# EAGLE design v3 Painting Machine Schematic (EAGLE 9.3.0)
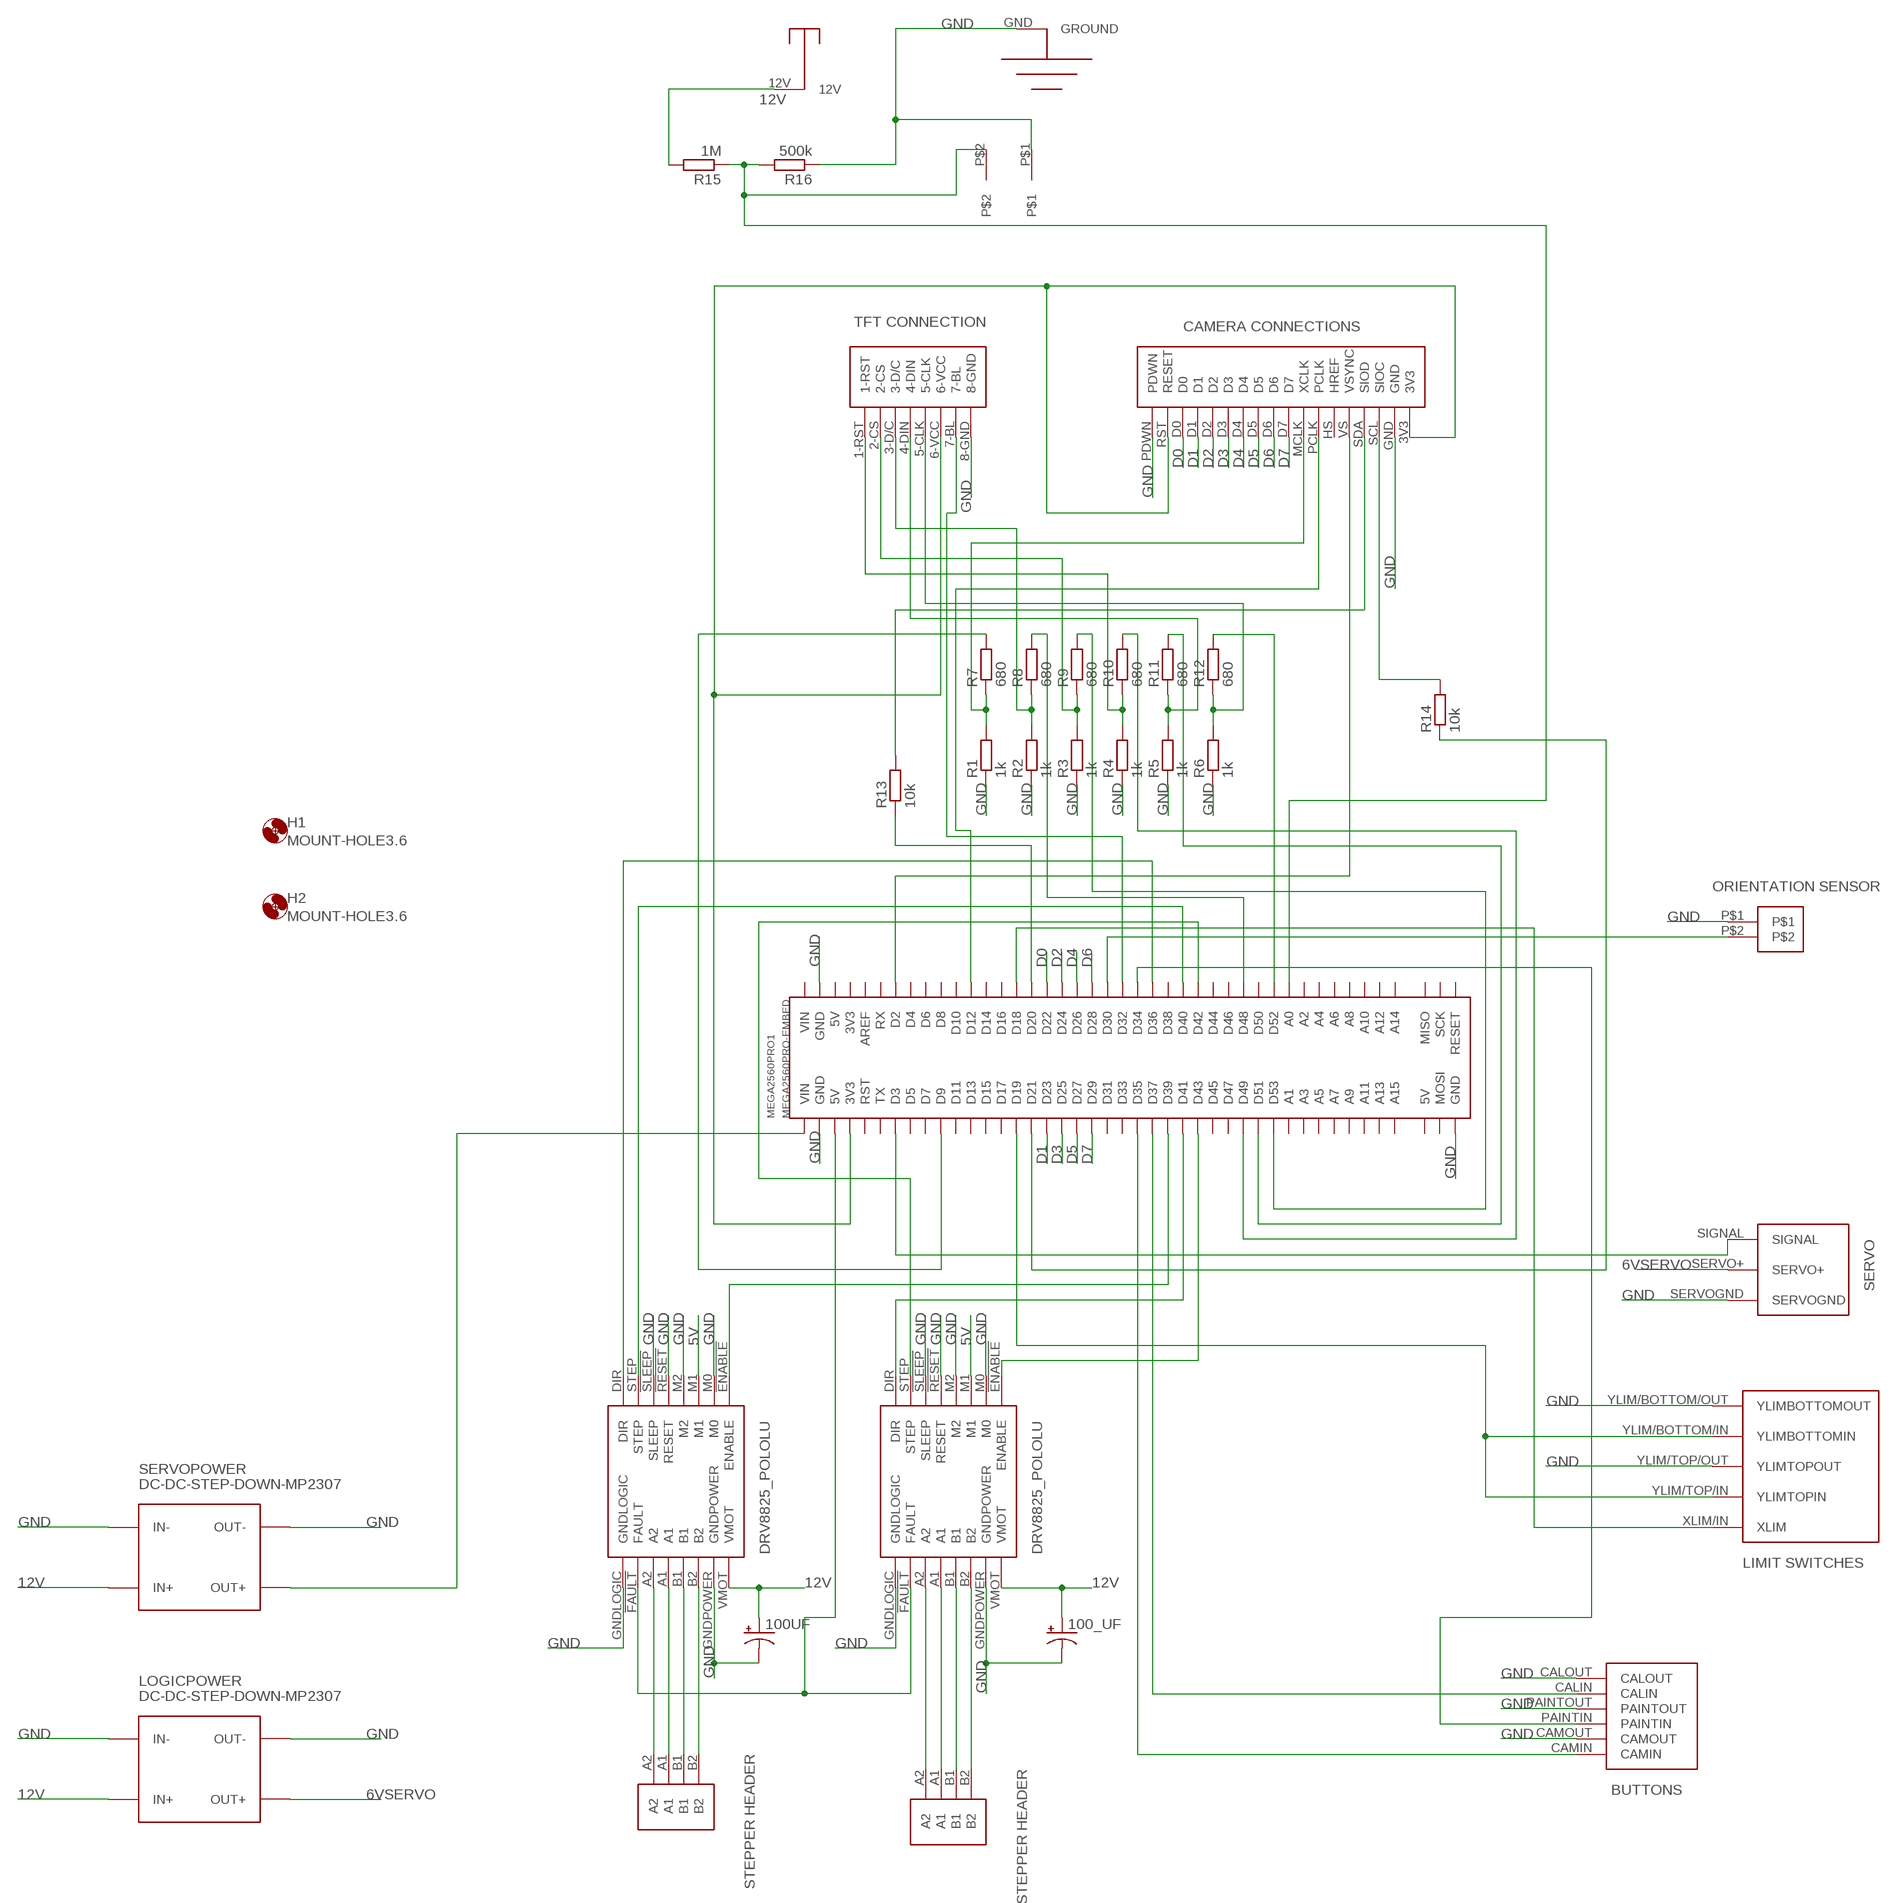
[diagram p0: schematic, sheet 1]

## Parts
100_UF  CPOL-USB45181B  [B45181B]
100UF  CPOL-USB45181B  [B45181B]
H1  MOUNT-HOLE3.6  [3,6]
H2  MOUNT-HOLE3.6  [3,6]
LOGICPOWER  DC-DC-STEP-DOWN-MP2307  [DC-DC-STEP-DOWN-MP2307]
MEGA2560PRO1  MEGA2560PRO-EMBED  [MEGA2560PRO-EMBED]
R1  1k  R-EU_0207/7  [0207/7]
R2  1k  R-EU_0207/7  [0207/7]
R3  1k  R-EU_0207/7  [0207/7]
R4  1k  R-EU_0207/7  [0207/7]
R5  1k  R-EU_0207/7  [0207/7]
R6  1k  R-EU_0207/7  [0207/7]
R7  680  R-EU_0207/7  [0207/7]
R8  680  R-EU_0207/7  [0207/7]
R9  680  R-EU_0207/7  [0207/7]
R10  680  R-EU_0207/7  [0207/7]
R11  680  R-EU_0207/7  [0207/7]
R12  680  R-EU_0207/7  [0207/7]
R13  10k  R-EU_0207/7  [0207/7]
R14  10k  R-EU_0207/7  [0207/7]
R15  1M  R-EU_0207/7  [0207/7]
R16  500k  R-EU_0207/7  [0207/7]
SERVOPOWER  DC-DC-STEP-DOWN-MP2307  [DC-DC-STEP-DOWN-MP2307]
U$1  DRV8825_POLOLU_CARRIER  [DRV8825_POLOLU]
U$2  DRV8825_POLOLU_CARRIER  [DRV8825_POLOLU]
U$4  TFT/CONNECTIONS  [TFTCONNECTIONS]
U$5  OV7670CONNECTIONS  [CAMERACONNECTIONS]
U$6  ORIENTATIONSENSOR  [ORIENTATIONSENSOR]
U$7  12V  [VCC]
U$8  GROUND  [GROUND]
U$9  STEPPER_HEADER  [STEPPER_HEADER]
U$10  STEPPER_HEADER  [STEPPER_HEADER]
U$11  SERVO  [SERVO]
U$12  LIMITSWITCHES  [LIMITSWITCHES]
U$13  BUTTONS  [INPUTBUTTONS]
U$14  CERAMICCAPACITOR  [CERAMICCAPACITOR]

## Nets
5V: U$1.M1 U$2.M1
6VSERVO: LOGICPOWER.OUT+ U$11.SERVO+
12V: 100_UF.+ 100UF.+ LOGICPOWER.IN+ R15.2 SERVOPOWER.IN+ U$1.VMOT U$2.VMOT U$7.12V
D0: MEGA2560PRO1.D22 U$5.D0
D1: MEGA2560PRO1.D23 U$5.D1
D2: MEGA2560PRO1.D24 U$5.D2
D3: MEGA2560PRO1.D25 U$5.D3
D4: MEGA2560PRO1.D26 U$5.D4
D5: MEGA2560PRO1.D27 U$5.D5
D6: MEGA2560PRO1.D28 U$5.D6
D7: MEGA2560PRO1.D29 U$5.D7
GND: 100_UF.- 100UF.- LOGICPOWER.IN- LOGICPOWER.OUT- MEGA2560PRO1.GND@1(GND) MEGA2560PRO1.GND@2(GND) MEGA2560PRO1.GND@3(GND) R1.1 R2.1 R3.1 R4.1 R5.1 R6.1 R16.1 SERVOPOWER.IN- SERVOPOWER.OUT- U$1.!RESET(RESET) U$1.!SLEEP(SLEEP) U$1.GNDLOGIC U$1.GNDPOWER U$1.M0 U$1.M2 U$2.!RESET(RESET) U$2.!SLEEP(SLEEP) U$2.GNDLOGIC U$2.GNDPOWER U$2.M0 U$2.M2 U$4.8-GND U$5.GND U$5.PDWN U$6.P$1 U$8.GND(GROUND) U$11.SERVOGND U$12.YLIM/BOTTOM/OUT(YLIMBOTTOMOUT) U$12.YLIM/TOP/OUT(YLIMTOPOUT) U$13.CALOUT U$13.CAMOUT U$13.PAINTOUT U$14.P$1
N$1: U$2.A2 U$9.A2
N$2: U$2.A1 U$9.A1
N$3: U$2.B1 U$9.B1
N$4: U$2.B2 U$9.B2
N$5: U$1.A2 U$10.A2
N$6: U$1.A1 U$10.A1
N$7: U$1.B1 U$10.B1
N$8: U$1.B2 U$10.B2
N$9: MEGA2560PRO1.D9 R7.2
N$10: MEGA2560PRO1.D48 R8.2
N$11: MEGA2560PRO1.D53 R9.2
N$12: MEGA2560PRO1.D49 R10.2
N$13: R5.2 R11.1 U$4.4-DIN
N$14: R6.2 R12.1 U$4.5-CLK
N$15: MEGA2560PRO1.D12 U$5.PCLK
N$16: MEGA2560PRO1.D52 R12.2
N$17: MEGA2560PRO1.D51 R11.2
N$18: R4.2 R10.1 U$4.1-RST
N$19: R3.2 R9.1 U$4.2-CS
N$20: R2.2 R8.1 U$4.3-D/C
N$21: MEGA2560PRO1.D20 R13.1
N$22: R1.2 R7.1 U$5.MCLK(XCLK)
N$23: R13.2 U$5.SDA(SIOD)
N$24: MEGA2560PRO1.D21 R14.1
N$25: R14.2 U$5.SCL(SIOC)
N$26: MEGA2560PRO1.3V3@1(3V3) U$4.6-VCC U$5.3V3 U$5.RST(RESET)
N$27: MEGA2560PRO1.D2 U$5.VS(VSYNC)
N$28: MEGA2560PRO1.D3 U$11.SIGNAL
N$29: MEGA2560PRO1.D30 U$6.P$2
N$30: MEGA2560PRO1.D19 U$12.YLIM/BOTTOM/IN(YLIMBOTTOMIN) U$12.YLIM/TOP/IN(YLIMTOPIN)
N$31: MEGA2560PRO1.D18 U$12.XLIM/IN(XLIM)
N$33: MEGA2560PRO1.D35 U$13.CAMIN
N$34: MEGA2560PRO1.D37 U$13.CALIN
N$35: MEGA2560PRO1.D34 U$13.PAINTIN
N$36: MEGA2560PRO1.D41 U$1.DIR
N$37: MEGA2560PRO1.D43 U$1.!ENABLE(ENABLE)
N$38: MEGA2560PRO1.D39 U$2.!ENABLE(ENABLE)
N$39: MEGA2560PRO1.D42 U$1.STEP
N$40: MEGA2560PRO1.D40 U$2.STEP
N$41: MEGA2560PRO1.D36 U$2.DIR
N$42: MEGA2560PRO1.5V@1(5V) U$1.!FAULT(FAULT) U$2.!FAULT(FAULT)
N$43: MEGA2560PRO1.D32 U$4.7-BL
N$44: MEGA2560PRO1.A0 R15.1 R16.2 U$14.P$2
VIN: MEGA2560PRO1.VIN@1(VIN) SERVOPOWER.OUT+
Unconnected: MEGA2560PRO1.3V3@2(3V3) MEGA2560PRO1.5V@2(5V) MEGA2560PRO1.5V@3(5V) MEGA2560PRO1.A1 MEGA2560PRO1.A2 MEGA2560PRO1.A3 MEGA2560PRO1.A4 MEGA2560PRO1.A5 MEGA2560PRO1.A6 MEGA2560PRO1.A7 MEGA2560PRO1.A8 MEGA2560PRO1.A9 MEGA2560PRO1.A10 MEGA2560PRO1.A11 MEGA2560PRO1.A12 MEGA2560PRO1.A13 MEGA2560PRO1.A14 MEGA2560PRO1.A15 MEGA2560PRO1.AREF MEGA2560PRO1.D4 MEGA2560PRO1.D5 MEGA2560PRO1.D6 MEGA2560PRO1.D7 MEGA2560PRO1.D8 MEGA2560PRO1.D10 MEGA2560PRO1.D11 MEGA2560PRO1.D13 MEGA2560PRO1.D14 MEGA2560PRO1.D15 MEGA2560PRO1.D16 MEGA2560PRO1.D17 MEGA2560PRO1.D31 MEGA2560PRO1.D33 MEGA2560PRO1.D38 MEGA2560PRO1.D44 MEGA2560PRO1.D45 MEGA2560PRO1.D46 MEGA2560PRO1.D47 MEGA2560PRO1.D50 MEGA2560PRO1.MISO MEGA2560PRO1.MOSI MEGA2560PRO1.RESET MEGA2560PRO1.RST MEGA2560PRO1.RX MEGA2560PRO1.SCK MEGA2560PRO1.TX MEGA2560PRO1.VIN@2(VIN) U$5.HS(HREF)

## Library data of the parts
100_UF 100UF = adafruit:CPOL-US: POLARIZED CAPACITOR, American symbol
H1 H2 = holes:MOUNT-HOLE: MOUNTING HOLE with drill center marker
LOGICPOWER SERVOPOWER = diy-modules:DC-DC-STEP-DOWN-MP2307: DC/DC Step-Down Regulator based on MP2307DN chip MP2307 datasheet available here: https://cdn-shop.adafruit.com/datasheets/MP2307_r1.9.pdf Click here to find device on ebay.com <http://www.ebay.com/sch/dc+dc+3a+mini+converter>
MEGA2560PRO1 = robotdyn:MEGA2560PRO-EMBED: Robotdyn Robotdyn Mega 2560 PRO (Embed) https://robotdyn.com/mega-2560-pro-embed-ch340g-atmega2560-16au.html
R1-R16 = resistor:R-EU_: RESISTOR, European symbol
U$1 U$2 = DRV8825_POLOLU:DRV8825_POLOLU_CARRIER: POLOLU DRV8825 carrier, through hole mounting. A PCB has been manufactured successfully using this EAGLE package, prior to uploading to diymodules.org
U$4 = Painting Machine Library:TFT/CONNECTIONS
U$5 = Painting Machine Library:OV7670CONNECTIONS
U$6 = Painting Machine Library:ORIENTATIONSENSOR
U$7 = BALANCING ROBOT:12V
U$8 = BALANCING ROBOT:GROUND
U$9 U$10 = BALANCING ROBOT:STEPPER_HEADER: STEPPER HEADER
U$11 = Painting Machine Library:SERVO
U$12 = Painting Machine Library:LIMITSWITCHES
U$13 = Painting Machine Library:BUTTONS
U$14 = Painting Machine Library:CERAMICCAPACITOR

## Net classes
0 default: width 0.406 mm, clearance 0.102 mm

## Board
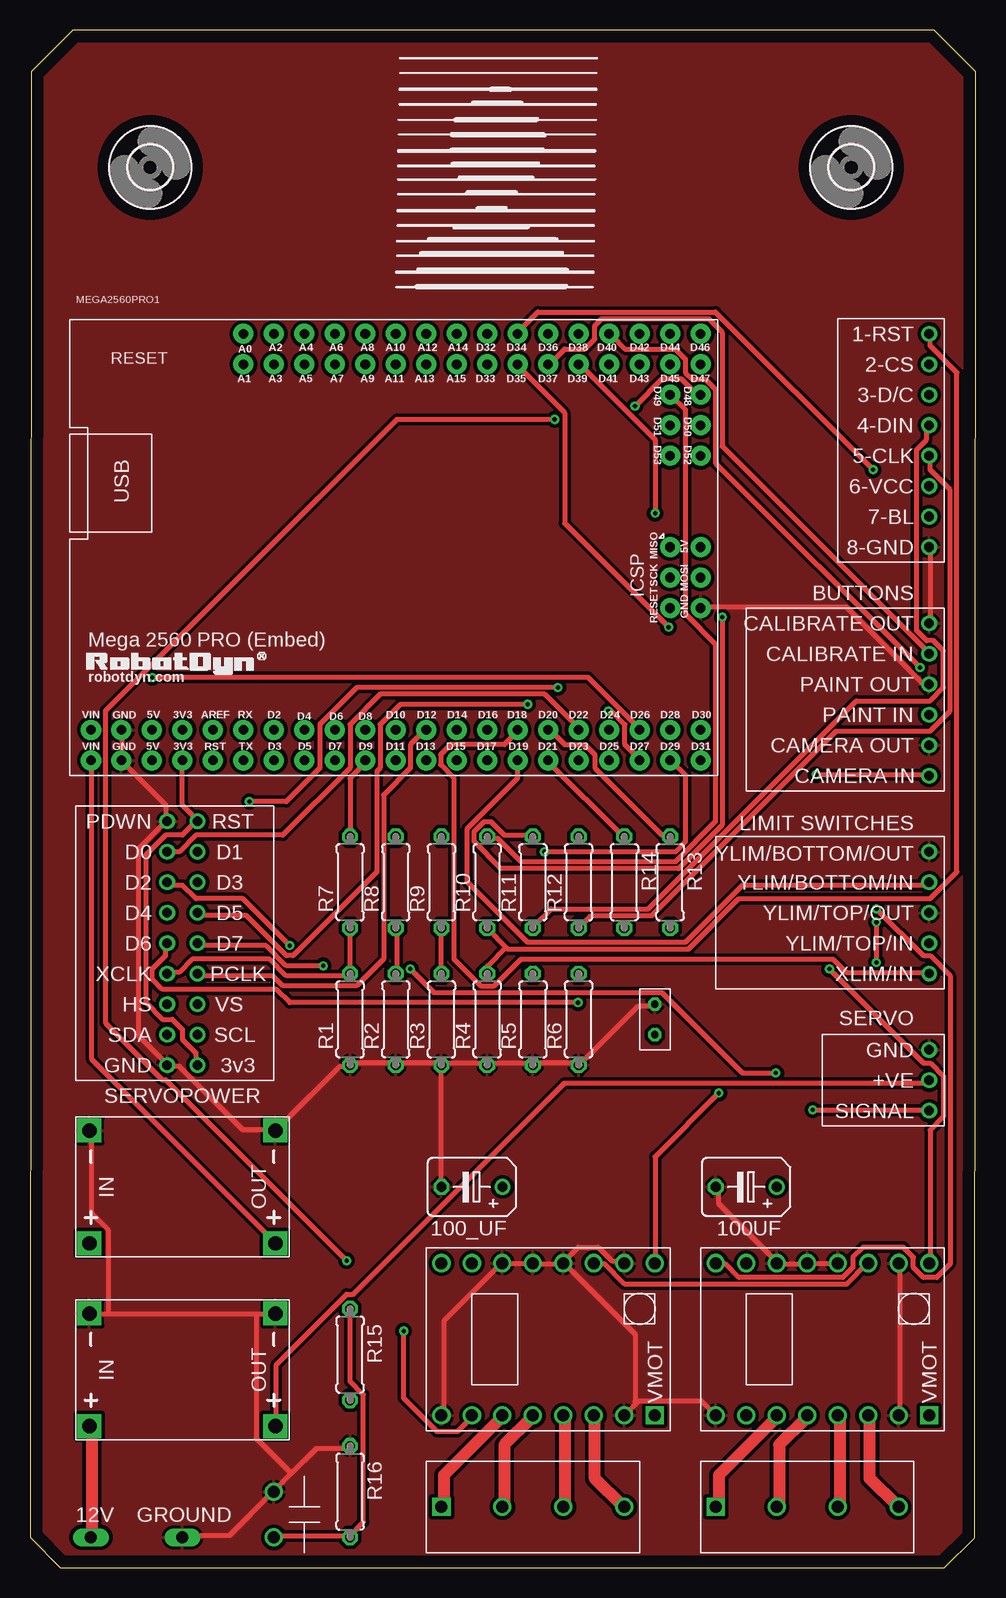
[diagram p1: board, top side]
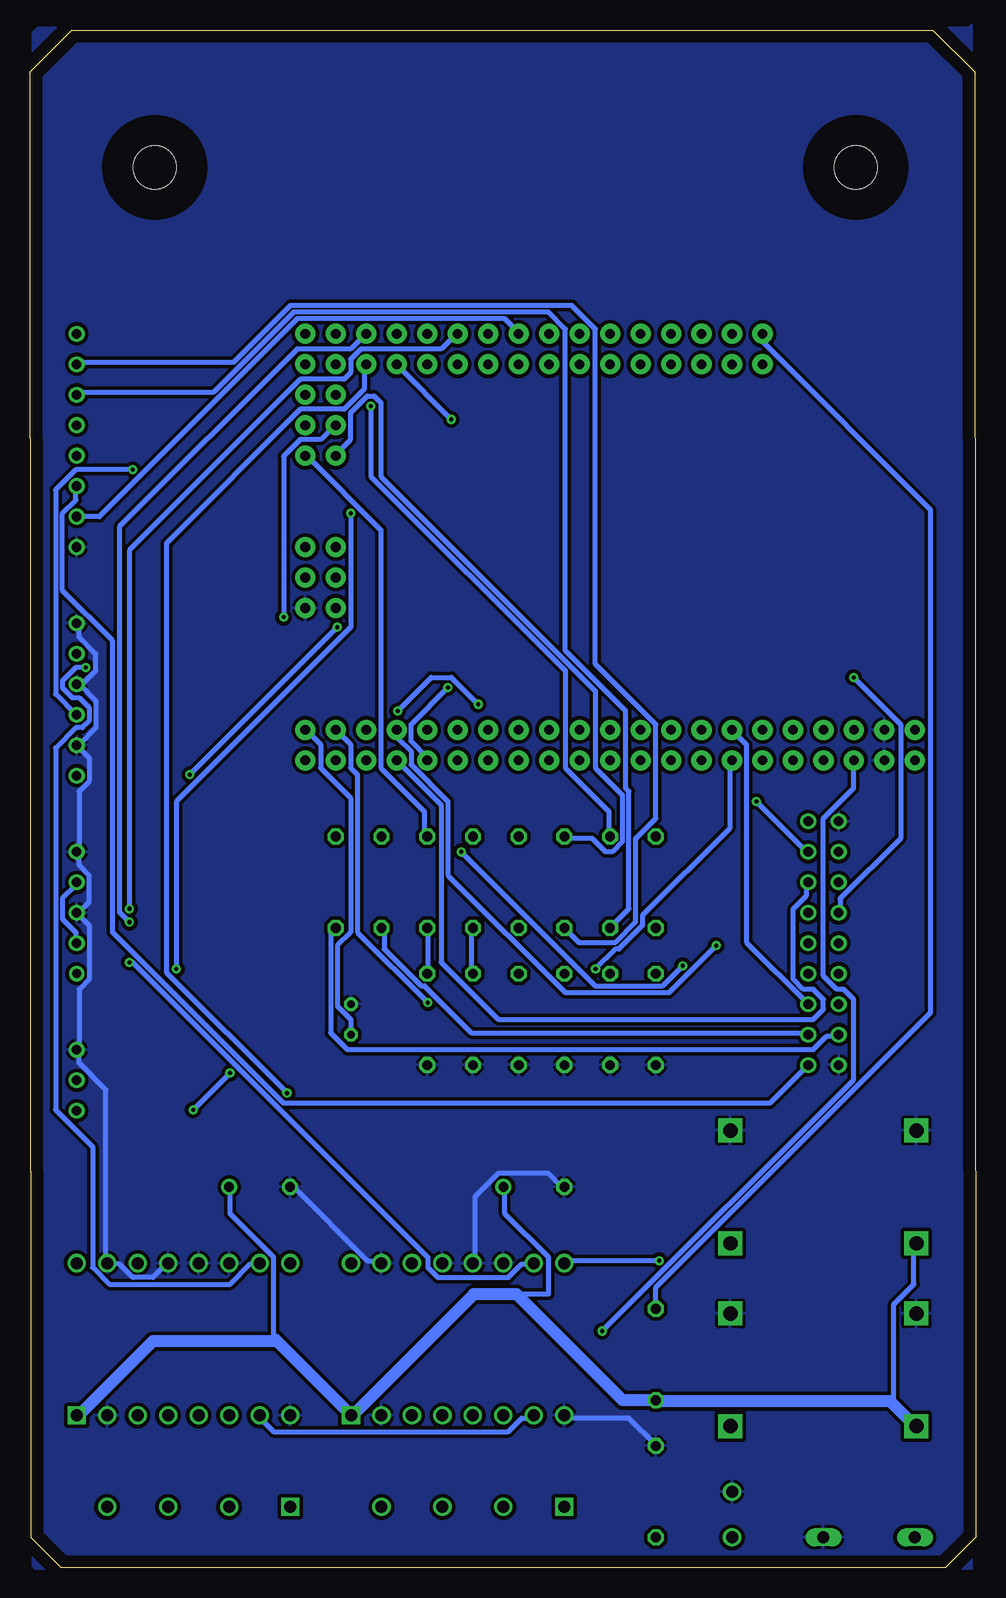
[diagram p2: board, bottom side, seen from below]

Size 78.82 x 128.19 mm. Coordinates in mm from the lower left corner, seen from the top.
Outline: 78.72,2.52 78.82,124.71 75.34,128.19 3.58,128.19 0.1,124.71 0,2.54 2.54,0 76.2,0 78.72,2.52
Copper layers (1*16): Top 0.035mm / dielectric 1.5mm / Bottom 0.035mm
Design rules "default": minimum track width 6mil, minimum drill 0.35mm, track to track 6mil, track to pad 6mil, pad to pad 6mil, via to via 6mil, smd to smd 6mil, copper to edge 40mil, drill to drill 6mil, minimum pad ring 10mil, minimum via ring 8mil, stop-mask expansion 4mil, vias tented up to drill 0mil, thermal gap 10mil

### Footprints (pad centres in the part's own frame; a part is rotated, then mirrored left to right if it is on the bottom)
B45181B = drill 0.813: + -2.54,0 | drill 0.813 octagon: - 2.54,0
3,6 = hole 3.6: 0,0
DC-DC-STEP-DOWN-MP2307 = drill 1.2 pad 2 square: IN+ -7.747,-4.699; IN- -7.747,4.699; OUT+ 7.747,-4.699; OUT- 7.747,4.699
MEGA2560PRO-EMBED = drill 0.8 pad 1.676: 3V3@1 -25.4,-19.05; 3V3@2 -25.4,-16.51; 5V@1 -27.94,-19.05; 5V@2 -27.94,-16.51; 5V@3 17.78,-1.27; A0 -20.32,16.51; A1 -20.32,13.97; A2 -17.78,16.51; A3 -17.78,13.97; A4 -15.24,16.51; A5 -15.24,13.97; A6 -12.7,16.51; A7 -12.7,13.97; A8 -10.16,16.51; A9 -10.16,13.97; A10 -7.62,16.51; A11 -7.62,13.97; A12 -5.08,16.51; A13 -5.08,13.97; A14 -2.54,16.51; A15 -2.54,13.97; AREF -22.86,-16.51; D2 -17.78,-16.51; D3 -17.78,-19.05; D4 -15.24,-16.51; D5 -15.24,-19.05; D6 -12.7,-16.51; D7 -12.7,-19.05; D8 -10.16,-16.51; D9 -10.16,-19.05; D10 -7.62,-16.51; D11 -7.62,-19.05; D12 -5.08,-16.51; D13 -5.08,-19.05; D14 -2.54,-16.51; D15 -2.54,-19.05; D16 0,-16.51; D17 0,-19.05; D18 2.54,-16.51; D19 2.54,-19.05; D20 5.08,-16.51; D21 5.08,-19.05; D22 7.62,-16.51; D23 7.62,-19.05; D24 10.16,-16.51; D25 10.16,-19.05; D26 12.7,-16.51; D27 12.7,-19.05; D28 15.24,-16.51; D29 15.24,-19.05; D30 17.78,-16.51; D31 17.78,-19.05; D32 0,16.51; D33 0,13.97; D34 2.54,16.51; D35 2.54,13.97; D36 5.08,16.51; D37 5.08,13.97; D38 7.62,16.51; D39 7.62,13.97; D40 10.16,16.51; D41 10.16,13.97; D42 12.7,16.51; D43 12.7,13.97; D44 15.24,16.51; D45 15.24,13.97; D46 17.78,16.51; D47 17.78,13.97; D48 17.78,11.43; D49 15.24,11.43; D50 17.78,8.89; D51 15.24,8.89; D52 17.78,6.35; D53 15.24,6.35; GND@1 -30.48,-19.05; GND@2 -30.48,-16.51; GND@3 17.78,-6.35; MISO 15.24,-1.27; MOSI 17.78,-3.81; RESET 15.24,-6.35; RST -22.86,-19.05; RX -20.32,-16.51; SCK 15.24,-3.81; TX -20.32,-19.05; VIN@1 -33.02,-19.05; VIN@2 -33.02,-16.51
0207/7 = drill 0.813 octagon: 1 -3.81,0; 2 3.81,0
DRV8825_POLOLU = drill 1: !ENABLE -6.35,8.89; !FAULT 6.35,-6.35; !RESET -6.35,-1.27; !SLEEP -6.35,-3.81; A1 6.35,-1.27; A2 6.35,-3.81; B1 6.35,1.27; B2 6.35,3.81; DIR -6.35,-8.89; GNDLOGIC 6.35,-8.89; GNDPOWER 6.35,6.35; M0 -6.35,6.35; M1 -6.35,3.81; M2 -6.35,1.27; STEP -6.35,-6.35 | drill 1 square: VMOT 6.35,8.89
TFTCONNECTIONS = drill 0.8: 1-RST -2.54,3.81; 2-CS -5.08,3.81; 3-D/C -7.62,3.81; 4-DIN -10.16,3.81; 5-CLK -12.7,3.81; 6-VCC -15.24,3.81; 7-BL -17.78,3.81; 8-GND -20.32,3.81
CAMERACONNECTIONS = drill 0.8: 3V3 -8.89,0; D0 8.89,2.54; D1 8.89,0; D2 6.35,2.54; D3 6.35,0; D4 3.81,2.54; D5 3.81,0; D6 1.27,2.54; D7 1.27,0; GND -8.89,2.54; HS -3.81,2.54; MCLK -1.27,2.54; PCLK -1.27,0; PDWN 11.43,2.54; RST 11.43,0; SCL -6.35,0; SDA -6.35,2.54; VS -3.81,0
ORIENTATIONSENSOR = drill 0.6 octagon: P$1 0,1.27; P$2 0,-1.27
VCC = drill 1 long: 12V 0,0
GROUND = drill 1 long: GND 0,0
STEPPER_HEADER = drill 1: A1 -2.54,1.27; B1 -2.54,6.35; B2 -2.54,11.43 | drill 1 square: A2 -2.54,-3.81
SERVO = drill 0.8: SERVO+ -6.35,0; SERVOGND -6.35,-2.54; SIGNAL -6.35,2.54
LIMITSWITCHES = drill 0.75: XLIM/IN -5.08,5.08 | drill 0.8: YLIM/BOTTOM/IN -5.08,-2.54; YLIM/BOTTOM/OUT -5.08,-5.08; YLIM/TOP/IN -5.08,2.54; YLIM/TOP/OUT -5.08,0
INPUTBUTTONS = drill 0.8: CALIN -2.54,-2.54; CALOUT -2.54,-5.08; CAMIN -2.54,7.62; CAMOUT -2.54,5.08; PAINTIN -2.54,2.54; PAINTOUT -2.54,0
CERAMICCAPACITOR = drill 1: P$1 -2.54,0; P$2 1.27,0

### Placement (x,y rotation side)
100_UF  36.83,31.75 180 top
100UF  59.69,31.75 180 top
H1  10.01,116.74 0 top
H2  68.43,116.74 0 top
LOGICPOWER  12.7,16.51 0 top
MEGA2560PRO1  38.1,86.36 0 top
R1  26.67,45.72 90 top
R2  30.48,45.72 90 top
R3  34.29,45.72 90 top
R4  38.1,45.72 90 top
R5  41.91,45.72 90 top
R6  45.72,45.72 90 top
R7  26.67,57.15 90 top
R8  30.48,57.15 90 top
R9  34.29,57.15 90 top
R10  38.1,57.15 90 top
R11  41.91,57.15 90 top
R12  45.72,57.15 90 top
R13  53.34,57.15 270 top
R14  49.53,57.15 270 top
R15  26.67,17.78 270 top
R16  26.67,6.35 270 top
SERVOPOWER  12.7,31.75 0 top
U$1  43.18,19.05 270 top
U$2  66.04,19.05 270 top
U$4  78.74,105.41 90 top
U$5  13.97,50.8 90 top
U$6  52.07,45.72 0 top
U$7  5.08,2.54 0 top
U$8  12.7,2.54 0 top
U$9  60.96,2.54 270 top
U$10  38.1,2.54 270 top
U$11  68.58,40.64 180 top
U$12  69.85,54.61 180 top
U$13  72.39,73.66 180 top
U$14  20.32,3.81 270 top

### Tracks (layer width: path | path; a pad name or v marks a point on that pad's centre or on a via)
5V
  Top 0.406: U$1.M1 47.07,25.32 47.9,25.32 49.58,23.65 68.02,23.65 69.7,25.32 U$2.M1
6VSERVO
  Top 0.406: U$11.SERVO+ 74.73,40.41 44.55,40.41 26.95,22.81 26.39,22.81 20.52,16.94 20.52,11.91 LOGICPOWER.OUT+
12V
  Top 0.406: 5.16,2.69 U$7.12V | 5.16,11.63 LOGICPOWER.IN+
  Top 1.016: 5.16,11.63 5.16,2.69
  Bottom 0.406: 100UF.+ 62.15,31.75 62.15,29.51 58.52,25.88 58.52,19.18 58.38,19.04 58.52,18.9 | 52.1,12.75 U$1.VMOT 51.94,12.73 | 74.73,12.75 U$2.VMOT | 7.11,13.87 6.97,13.73 6.83,13.87 6.83,21.97 5.16,23.65 5.16,27 SERVOPOWER.IN+ | 26.67,13.87 R15.2 | 5.16,11.91 LOGICPOWER.IN+ | 100_UF.+ 39.24,31.75 39.24,29.51 35.61,25.88 35.61,22.81 38.28,22.81
  Bottom 1.016: 52.1,12.75 58.38,19.04 | 74.73,12.75 68.58,18.9 58.52,18.9 | 7.11,13.87 26.67,13.87 | 5.16,11.91 6.97,13.73 | R15.2 29.44,13.97 38.28,22.81 41.86,22.81 51.94,12.73
D0
  Top 0.406: U$5.D0 12.42,59.69 13.82,61.09 21.08,61.09 26.67,66.68 26.67,70.31 29.18,72.82 42.88,72.82 45.67,70.03 MEGA2560PRO1.D22
D1  (via drill 0.35)
  Top 0.406: v18.29,63.88 21.36,63.88 24.16,66.68 24.16,70.31 27.23,73.38 v43.99,73.38
  Bottom 0.406: v18.29,63.88 14.1,59.69 U$5.D1 | v43.99,73.38 47.07,70.31 47.07,68.91 45.67,67.51 MEGA2560PRO1.D23
D2  (via drill 0.35)
  Top 0.406: v21.64,51.87 17.73,55.78 13.82,55.78 12.7,56.9 11.58,56.9 U$5.D2
  Bottom 0.406: v21.64,51.87 25.55,47.96 34.21,47.96 43.99,57.73 43.99,63.88 47.07,66.95 47.07,68.07 48.18,69.19 48.18,69.75 MEGA2560PRO1.D24
D3
  Bottom 0.406: MEGA2560PRO1.D25 44.55,63.6 44.55,50.47 39.8,45.72 13.54,45.72 12.7,46.56 12.7,47.4 13.54,48.23 14.38,48.23 15.21,49.07 15.21,54.94 14.1,56.06 14.1,56.9 U$5.D3
D4  (via drill 0.35)
  Top 0.406: v10.19,74.22 46.51,74.22 50.7,70.03 MEGA2560PRO1.D26
  Bottom 0.406: v10.19,74.22 6.27,70.31 6.27,60.81 11.3,55.78 11.3,54.66 U$5.D4
D5  (via drill 0.35)
  Top 0.406: v41.48,71.98 30.86,71.98 29.18,70.31 29.18,66.68 28.91,66.4 28.91,58.01 21.92,51.03 21.36,51.03 18.01,54.38 14.1,54.38 U$5.D5 | v48.18,71.42 48.46,71.42 49.58,70.31 49.58,68.63 50.7,67.51 MEGA2560PRO1.D27
  Bottom 0.406: v41.48,71.98 43.71,74.22 45.39,74.22 v48.18,71.42
D6  (via drill 0.35)
  Top 0.406: v45.67,47.12 21.64,47.12 20.52,48.23 11.02,48.23 10.19,49.07 10.19,49.91 11.3,51.03 11.3,51.87 U$5.D6
  Bottom 0.406: v45.67,47.12 51.54,52.98 51.54,66.12 52.1,66.68 52.1,68.63 53.21,69.75 MEGA2560PRO1.D28
D7  (via drill 0.35)
  Top 0.406: v24.43,50.19 21.36,50.19 19.68,51.87 14.1,51.87 U$5.D7 | v42.88,59.69 53.77,59.69 54.61,60.53 54.61,66.12 53.49,67.23 MEGA2560PRO1.D29
  Bottom 0.406: v24.43,50.19 26.11,48.51 31.7,48.51 v42.88,59.69
GND
  Top 0.406: 21.78,7.86 20.52,6.6 U$14.P$1 20.24,6.32 16.61,2.69 12.7,2.69 U$8.GND | 21.78,7.86 23.88,9.96 26.67,9.96 R16.1 | 18.85,21.13 20.24,21.13 LOGICPOWER.OUT- | 18.85,21.13 6.55,21.13 | 6.55,21.13 5.16,21.13 LOGICPOWER.IN- | 6.55,21.13 6.55,28.12 5.16,29.51 5.16,36.22 SERVOPOWER.IN- | 21.78,7.86 18.85,10.8 18.85,21.13 | U$13.CALOUT 75.01,78.97 75.01,84.84 U$4.8-GND | U$13.PAINTOUT 74.45,73.66 68.02,80.09 56.01,80.09 MEGA2560PRO1.GND@3 | 50.56,13.73 50.7,13.87 56.01,13.87 57.12,12.75 U$2.GNDLOGIC | 50.56,13.73 U$1.GNDPOWER | U$1.M2 44.27,25.32 42.04,25.32 U$1.!RESET 41.76,25.32 39.52,25.32 U$1.!SLEEP 39.24,25.32 34.49,20.57 34.49,12.75 U$1.GNDLOGIC | U$1.M0 49.3,25.6 48.46,25.6 47.35,26.72 45.67,26.72 44.55,25.6 U$1.M2 | 50.56,13.73 50.42,13.87 50.42,19.46 44.55,25.32 U$1.M2 | U$2.GNDPOWER 72.49,12.75 72.49,25.32 U$2.M0 | U$2.M2 67.18,25.32 64.95,25.32 U$2.!RESET 64.67,25.32 62.43,25.32 U$2.!SLEEP 62.15,25.6 57.4,30.35 57.4,31.75 100UF.- | U$6.P$1 51.82,46.84 50.7,46.84 45.95,42.09 R6.1 45.67,42.09 42.04,42.09 R5.1 41.76,42.09 38.13,42.09 R4.1 37.85,42.09 34.49,42.09 R3.1 | 100_UF.- 34.21,31.75 34.21,41.81 R3.1 | R3.1 34.21,42.09 30.58,42.09 R2.1 30.3,42.09 26.67,42.09 R1.1 26.67,41.81 25.83,41.81 20.52,36.5 SERVOPOWER.OUT- 20.24,36.5 17.73,36.5 12.42,41.81 11.58,41.81 U$5.GND 11.3,42.09 9.07,44.32 9.07,59.97 11.3,62.2 U$5.PDWN 11.3,62.48 11.3,63.6 7.67,67.23 MEGA2560PRO1.GND@1 7.67,67.51 7.67,69.75 MEGA2560PRO1.GND@2
  Bottom 0.406: U$1.GNDLOGIC 34.21,12.47 28.91,12.47 26.67,10.24 R16.1 | 74.73,59.69 74.73,58.57 73.89,57.73 73.89,55.5 74.73,54.66 U$12.YLIM/TOP/OUT 74.73,54.38 73.89,53.54 73.89,49.07 74.73,48.23 74.73,43.21 U$11.SERVOGND 74.73,42.93 74.73,42.09 72.49,39.85 72.49,25.6 U$2.M0 72.21,25.32 71.37,25.32 70.26,24.21 68.58,24.21 67.46,25.32 U$2.M2 | U$13.CALOUT 74.73,78.69 74.73,77.57 73.33,76.17 73.33,74.78 74.45,73.66 U$13.PAINTOUT 74.73,73.66 73.33,72.26 73.33,70.03 74.73,68.63 U$13.CAMOUT 74.73,68.35 73.89,67.51 73.89,65.56 74.73,64.72 74.73,59.69 | 74.73,59.69 U$12.YLIM/BOTTOM/OUT | 100UF.- 56.85,31.75 50.7,25.6 49.58,25.6 U$1.M0 | U$1.!RESET 41.76,25.6 41.76,30.91 39.8,32.87 35.61,32.87 34.49,31.75 100_UF.-
  pour Top (isolate 0.305): 0.3,2.08 0.51,2.08 2.39,0.2 76,0.2 78.54,2.74 78.54,125.02 75.13,128.42 3.81,128.42 0.05,124.66 0.05,2.34
  pour Bottom (isolate 0.305): 0.36,128.68 0.36,-0.1 78.33,-0.1 78.59,0.15 78.59,128.02 78.18,128.42 0.61,128.42
N$1
  Top 0.406: 57.4,5.21 U$9.A2 | 62.15,12.47 U$2.A2
  Top 1.016: 57.4,5.21 57.4,7.72 62.15,12.47
N$2
  Top 0.406: 62.43,5.21 U$9.A1 | 64.67,12.47 U$2.A1
  Top 1.016: 62.43,5.21 62.43,10.24 64.67,12.47
N$3
  Top 0.406: 67.46,5.21 U$9.B1 | 67.46,12.47 U$2.B1
  Top 1.016: 67.46,12.47 67.46,5.21
N$4
  Top 0.406: 69.98,12.47 U$2.B2 | 72.21,5.21 U$9.B2
  Top 1.016: 69.98,12.47 69.98,7.44 72.21,5.21
N$5
  Top 0.406: 34.49,5.21 U$10.A2 | 39.24,12.47 U$1.A2
  Top 1.016: 34.49,5.21 34.49,7.72 39.24,12.47
N$6
  Top 0.406: 39.52,5.21 U$10.A1 | 41.76,12.47 U$1.A1
  Top 1.016: 39.52,5.21 39.52,10.24 41.76,12.47
N$7
  Top 0.406: 44.55,5.21 U$10.B1 | 44.55,12.47 U$1.B1
  Top 1.016: 44.55,12.47 44.55,5.21
N$8
  Top 0.406: 47.07,12.47 U$1.B2 | 49.3,5.21 U$10.B2
  Top 1.016: 47.07,12.47 47.07,7.44 49.3,5.21
N$9
  Top 0.406: R7.2 26.67,65.84 28.07,67.23 MEGA2560PRO1.D9
N$10  (via drill 0.35)
  Top 0.406: v50.42,96.85 52.65,99.09 54.33,99.09 55.73,97.69 MEGA2560PRO1.D48
  Bottom 0.406: v50.42,96.85 50.42,90.98 34.21,74.78 34.21,66.68 30.58,63.04 30.58,61.09 R8.2
N$11
  Bottom 0.406: R9.2 34.21,60.81 31.98,60.81 30.86,59.69 30.3,59.69 29.46,60.53 29.46,64.44 31.7,66.68 31.7,73.1 49.58,90.98 49.58,97.13 50.14,97.69 50.7,97.69 52.1,96.29 52.1,94.06 53.21,92.94 MEGA2560PRO1.D53
N$12
  Top 0.406: R10.2 38.13,60.81 38.96,60.81 40.92,58.85 53.77,58.85 57.12,62.2 57.12,77.01 54.61,79.53 54.61,96.57 53.49,97.69 MEGA2560PRO1.D49
N$13
  Top 0.406: U$4.4-DIN 74.73,95.17 74.73,94.06 73.89,93.22 73.89,78.13 74.73,77.29 75.29,77.29 76.12,76.45 76.12,73.38 75.01,72.26 68.86,72.26 51.54,54.94 43.43,54.94 42.04,53.54 R11.1
  Bottom 0.406: R5.2 42.04,49.63 42.04,53.26 R11.1
N$14
  Top 0.406: U$4.5-CLK 75.01,92.66 75.01,91.54 76.68,89.87 76.68,71.42 75.01,69.75 67.18,69.75 51.82,54.38 46.79,54.38 45.95,53.54 R12.1
  Bottom 0.406: R6.2 45.67,49.63 45.67,53.26 R12.1
N$15
  Top 0.406: U$5.PCLK 14.1,49.35 20.24,49.35 21.08,48.51 27.23,48.51 29.46,50.75 29.46,64.44 31.7,66.68 31.7,68.63 32.82,69.75 MEGA2560PRO1.D12
N$16
  Bottom 0.406: R12.2 45.95,61.09 45.95,63.04 49.58,66.68 49.58,86.51 55.73,92.66 MEGA2560PRO1.D52
N$17  (via drill 0.35)
  Top 0.406: v57.68,79.25 57.68,61.93 54.05,58.29 39.24,58.29 37.01,60.53 37.01,61.37 37.85,62.2 38.4,62.2 39.52,61.09 41.76,61.09 R11.2
  Bottom 0.406: v57.68,79.25 57.68,92.66 56.29,94.06 54.61,94.06 53.49,95.17 MEGA2560PRO1.D51
N$18
  Top 0.406: 39.66,51.73 38.13,53.26 R10.1 | 39.66,51.73 39.8,51.59 54.89,51.59 59.08,55.78 75.01,55.78 77.24,58.01 77.24,99.64 75.01,101.88 75.01,102.72 U$4.1-RST | 39.66,51.73 38.13,50.19 38.13,49.63 R4.2
N$19
  Top 0.406: R3.2 34.21,49.63 34.21,53.26 R9.1
  Bottom 0.406: R9.1 33.1,52.15 30.02,52.15 28.35,53.82 28.35,60.81 26.67,62.48 26.67,70.31 31.7,75.34 31.7,103.28 33.65,105.23 57.12,105.23 61.87,100.48 74.73,100.48 U$4.2-CS
N$20
  Top 0.406: R2.2 30.58,49.63 30.58,53.26 R8.1
  Bottom 0.406: U$4.3-D/C 74.73,97.97 63.55,97.97 56.85,104.67 35.61,104.67 34.21,103.28 34.21,76.45 29.18,71.42 29.18,65 28.91,64.72 28.91,54.94 30.3,53.54 R8.1
N$21
  Top 0.406: R13.1 53.21,61.09 52.65,61.09 47.07,66.68 47.07,67.79 46.23,68.63 44.55,68.63 43.43,69.75 MEGA2560PRO1.D20
N$22
  Top 0.406: U$5.MCLK 11.58,49.63 12.42,49.63 13.54,50.75 19.96,50.75 21.36,49.35 26.67,49.35 R1.2 R7.1
N$23
  Bottom 0.406: U$5.SDA 11.58,44.32 12.42,44.32 13.54,43.21 52.37,43.21 53.77,44.6 53.77,52.98 53.49,53.26 R13.2
N$24
  Top 0.406: R14.1 49.3,61.09 43.15,67.23 MEGA2560PRO1.D21
N$25
  Bottom 0.406: U$5.SCL 14.1,44.6 42.04,44.6 45.95,48.51 46.23,48.51 49.3,51.59 49.3,53.26 R14.2
N$26
  Top 0.406: U$5.3V3 13.82,42.09 13.82,42.93 12.7,44.04 12.7,44.88 11.86,45.72 11.02,45.72 9.63,47.12 9.63,59.41 11.3,61.09 12.7,61.09 13.82,62.2 U$5.RST 13.82,62.48 12.7,63.6 MEGA2560PRO1.3V3@1
  Bottom 0.406: U$4.6-VCC 75.01,90.14 75.01,89.03 76.12,87.91 76.12,81.48 71.93,77.29 71.93,52.98 57.68,38.74 17.17,38.74 14.1,41.81 U$5.3V3
N$27
  Bottom 0.406: U$5.VS 19.13,52.15 19.13,68.63 20.24,69.75 MEGA2560PRO1.D2
N$28  (via drill 0.35)
  Top 0.406: v65.23,38.18 74.73,38.18 U$11.SIGNAL | v62.15,41.25 59.36,41.25 52.65,47.96 33.65,47.96 v31.7,49.91
  Bottom 0.406: v62.15,41.25 v65.23,38.18 | v31.7,49.91 30.02,51.59 29.74,51.59 27.79,53.54 27.79,54.38 20.52,61.65 20.52,67.23 MEGA2560PRO1.D3
N$29
  Bottom 0.406: U$6.P$2 52.1,44.6 52.1,45.72 53.21,46.84 53.21,51.87 52.1,52.98 52.1,64.16 54.61,66.68 54.61,68.63 55.73,69.75 MEGA2560PRO1.D30
N$30
  Top 0.406: MEGA2560PRO1.D19 40.64,65.84 36.45,61.65 36.45,57.18 41.48,52.15 54.61,52.15 59.36,56.9 74.73,56.9 U$12.YLIM/BOTTOM/IN
  Bottom 0.406: U$12.YLIM/TOP/IN 75.01,52.15 75.01,52.98 76.12,54.1 76.12,55.78 75.01,56.9 U$12.YLIM/BOTTOM/IN
N$31
  Top 0.406: U$12.XLIM/IN 74.73,49.63 68.02,49.63 66.9,50.75 40.92,50.75 38.68,48.51 37.57,48.51 35.33,50.75 35.33,65.84 34.21,66.95 34.21,67.79 35.05,68.63 39.52,68.63 40.64,69.75 MEGA2560PRO1.D18
N$33  (via drill 0.35)
  Top 0.406: v65.51,66.12 74.73,66.12 U$13.CAMIN | v53.21,78.41 44.55,87.07 44.55,96.29 40.64,100.2 MEGA2560PRO1.D35
  Bottom 0.406: v53.21,78.41 v65.51,66.12
N$34
  Top 0.406: U$13.CALIN 74.73,76.45 57.68,93.5 57.68,103 56.57,104.11 47.62,104.11 47.07,103.56 47.07,102.44 46.23,101.6 44.55,101.6 43.43,100.48 MEGA2560PRO1.D37
N$35  (via drill 0.35)
  Top 0.406: v70.26,91.54 57.12,104.67 42.32,104.67 40.64,103 MEGA2560PRO1.D34
  Bottom 0.406: v70.26,91.54 75.01,91.54 76.68,89.87 76.68,72.82 75.01,71.15 U$13.PAINTIN
N$36  (via drill 0.35)
  Top 0.406: v26.39,25.6 11.3,40.69 11.02,40.69 6.27,45.44 6.27,71.42 30.58,95.73 v43.71,95.73
  Bottom 0.406: v26.39,25.6 34.21,25.6 U$1.DIR | v43.71,95.73 48.18,100.2 MEGA2560PRO1.D41
N$37  (via drill 0.35)
  Top 0.406: v57.4,39.57 52.1,34.26 52.1,25.6 U$1.!ENABLE
  Bottom 0.406: v57.4,39.57 67.46,49.63 67.46,85.39 56.29,96.57 52.65,96.57 50.98,98.25 50.98,100.2 MEGA2560PRO1.D43
N$38  (via drill 0.35)
  Top 0.406: v66.62,49.91 74.45,42.09 75.01,42.09 76.12,40.97 76.12,37.62 75.01,36.5 75.01,25.6 U$2.!ENABLE | v52.1,87.91 52.1,94.06 45.95,100.2 MEGA2560PRO1.D39
  Bottom 0.406: v66.62,49.91 66.62,63.88 52.1,78.41 v52.1,87.91
N$39  (via drill 0.35)
  Top 0.406: v70.54,53.82 v70.54,50.47
  Bottom 0.406: v70.54,50.47 70.26,50.47 45.67,25.88 45.67,25.04 44.83,24.21 38.96,24.21 37.85,25.32 37.01,25.32 U$1.STEP | v70.54,53.82 71.37,54.66 71.37,86.79 56.57,101.6 52.1,101.6 50.98,102.72 MEGA2560PRO1.D42
N$40  (via drill 0.35)
  Top 0.406: v74.17,75.06 57.12,92.1 57.12,98.25 56.29,99.09 55.17,99.09 54.61,99.64 54.61,100.76 53.77,101.6 49.58,101.6 48.46,102.72 MEGA2560PRO1.D40
  Bottom 0.406: v74.17,75.06 75.01,75.06 76.12,73.94 76.12,73.38 75.29,72.54 74.73,72.54 73.89,71.7 73.89,70.59 74.45,70.03 75.01,70.03 76.68,68.35 76.68,38.18 73.61,35.1 73.61,25.04 72.21,23.65 62.15,23.65 60.48,25.32 59.92,25.32 U$2.STEP
N$41  (via drill 0.35)
  Top 0.406: v70.54,54.94 74.45,51.03 75.01,51.03 76.68,49.35 76.68,25.32 75.56,24.21 74.45,24.21 73.61,25.04 73.61,25.88 72.77,26.72 69.42,26.72 68.58,25.88 68.58,25.04 67.74,24.21 59.08,24.21 57.96,25.32 57.4,25.32 U$2.DIR
  Bottom 0.406: v70.54,54.94 70.54,84.84 56.29,99.09 52.65,99.09 52.1,99.64 52.1,100.76 51.26,101.6 44.55,101.6 43.43,102.72 MEGA2560PRO1.D36
N$42  (via drill 0.35)
  Top 0.406: v31.14,19.74 31.14,14.15 33.93,11.35 35.61,11.35 36.73,12.47 U$1.!FAULT
  Bottom 0.406: U$1.!FAULT 37.01,12.47 37.85,12.47 38.96,11.35 58.52,11.35 59.64,12.47 U$2.!FAULT | v31.14,19.74 10.19,40.69 10.19,47.4 11.02,48.23 11.58,48.23 12.7,49.35 12.7,62.48 10.19,65 10.19,67.23 MEGA2560PRO1.5V@1
N$43
  Bottom 0.406: U$4.7-BL 73.05,87.63 56.57,104.11 39.24,104.11 38.13,103 MEGA2560PRO1.D32
N$44
  Top 0.406: 26.67,2.69 20.52,2.69 U$14.P$2 | R15.1 26.67,15.54 27.79,14.43 27.79,3.81 26.67,2.69 | 26.67,2.69 R16.2
  Bottom 0.406: R15.1 26.67,23.37 3.76,46.28 3.76,88.19 17.73,102.16 17.73,102.72 MEGA2560PRO1.A0
VIN
  Top 0.406: MEGA2560PRO1.VIN@1 5.16,67.23 5.16,42.37 20.24,27.28 SERVOPOWER.OUT+